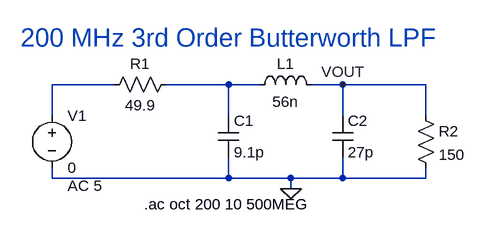
[diagram p0: schematic 200MLPF.asc]
200MLPF.asc, the LTspice schematic file:
Version 4
SHEET 1 880 680
WIRE -80 112 -176 112
WIRE 96 112 0 112
WIRE 144 112 96 112
WIRE 272 112 224 112
WIRE 400 112 272 112
WIRE -176 160 -176 112
WIRE 96 160 96 112
WIRE 272 160 272 112
WIRE 400 160 400 112
WIRE -176 256 -176 240
WIRE 96 256 96 224
WIRE 96 256 -176 256
WIRE 192 256 96 256
WIRE 272 256 272 224
WIRE 272 256 192 256
WIRE 400 256 400 240
WIRE 400 256 272 256
WIRE 192 272 192 256
FLAG 192 272 0
FLAG 272 112 VOUT
SYMBOL cap 80 160 R0
SYMATTR InstName C1
SYMATTR Value 9.1p
SYMBOL ind 128 128 R270
WINDOW 0 32 56 VTop 2
WINDOW 3 5 56 VBottom 2
SYMATTR InstName L1
SYMATTR Value 56n
SYMBOL cap 256 160 R0
SYMATTR InstName C2
SYMATTR Value 27p
SYMBOL voltage -176 144 R0
WINDOW 123 24 124 Left 2
WINDOW 39 0 0 Left 0
SYMATTR InstName V1
SYMATTR Value 0
SYMATTR Value2 AC 5
SYMBOL res 16 96 R90
WINDOW 0 0 56 VBottom 2
WINDOW 3 32 56 VTop 2
SYMATTR InstName R1
SYMATTR Value 49.9
SYMBOL res 384 144 R0
SYMATTR InstName R2
SYMATTR Value 150
TEXT -34 296 Left 2 !.ac oct 200 10 500MEG
TEXT -224 40 Left 4 ;200 MHz 3rd Order Butterworth LPF

The netlist it stands for:
* 200MLPF.asc
C1 N002 0 9.1p
L1 N002 VOUT 56n
C2 VOUT 0 27p
V1 N001 0 0 AC 5
R1 N002 N001 49.9
R2 VOUT 0 150
.ac oct 200 10 500MEG
* 200 MHz 3rd Order Butterworth LPF
.backanno
.end